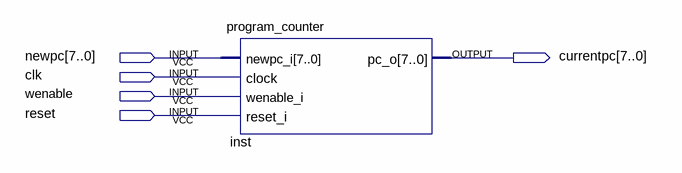
[diagram p0: schematic sheet]
// Quartus schematic walkthrough.bdf as structural Verilog: 1 symbols, 5 pins
module walkthrough (
  input  [7:0] newpc,
  input  clk,
  input  wenable,
  input  reset,
  output [7:0] currentpc
);

  program_counter inst (.newpc_i(newpc), .clock(clk), .wenable_i(wenable), .reset_i(reset), .pc_o(currentpc));
endmodule
